# EAGLE schematic GNS_430_PCB_v7 (EAGLE 9.7.0)
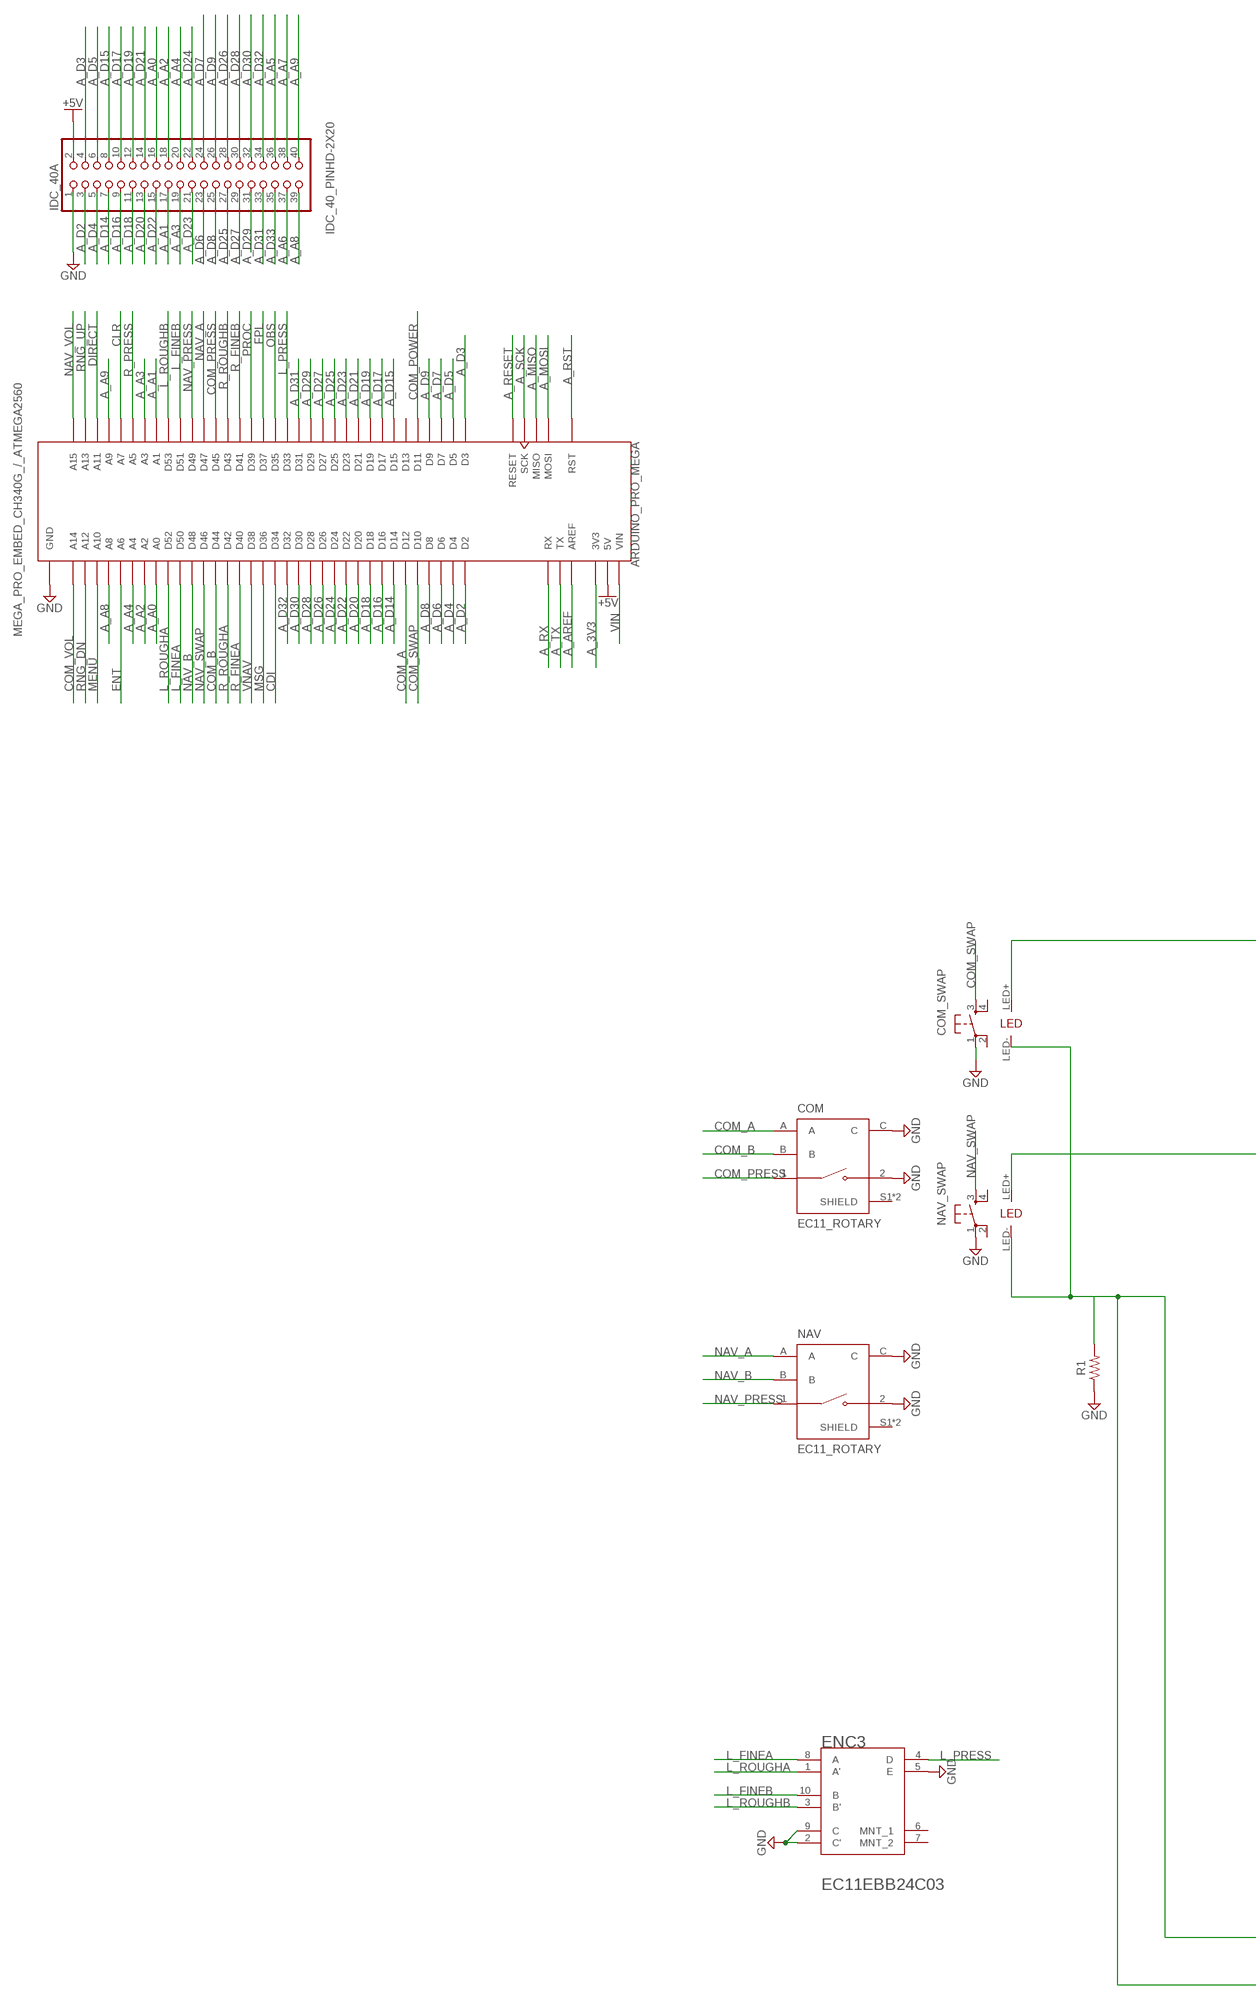
[diagram p0: schematic, sheet 1, part 1 of 2]
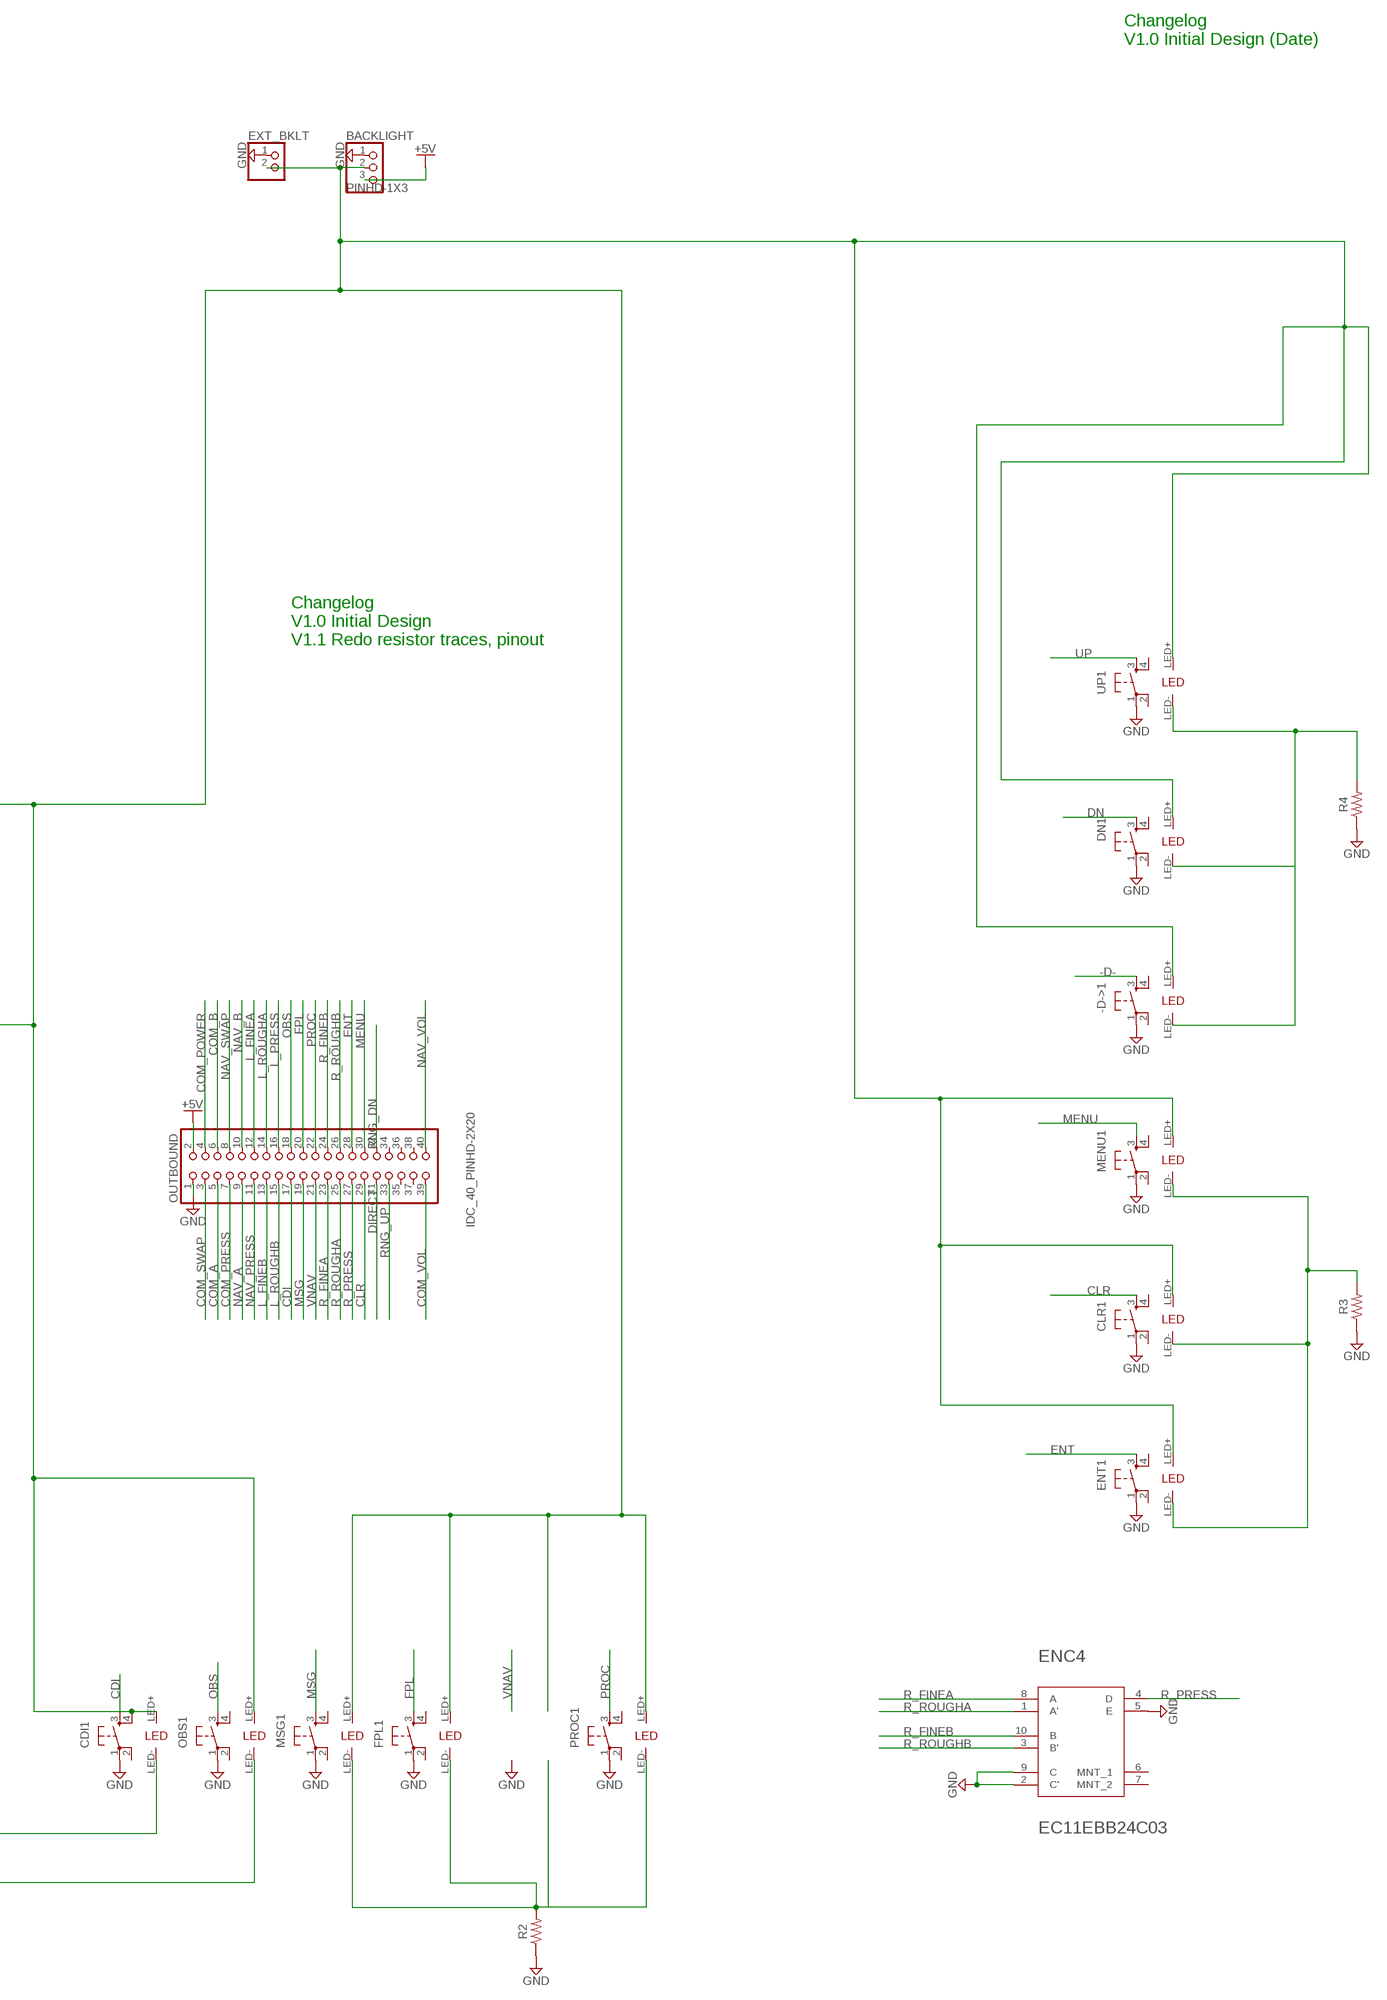
[diagram p1: schematic, sheet 1, part 2 of 2]

## Parts
-D->1  LED_PUSH_7MM  [LED_PUSH_7MM]
ARDUINO_PRO_MEGA  MEGA_PRO_EMBED_CH340G_/_ATMEGA2560  [MODULE_MEGA_PRO_EMBED_CH340G_/_ATMEGA2560]
BACKLIGHT  PINHD-1X3  [1X03]
CDI1  LED_PUSH_7MM  [LED_PUSH_7MM]
CLR1  LED_PUSH_7MM  [LED_PUSH_7MM]
COM  EC11_ROTARY  [SW_482016514001]
COM_SWAP  LED_PUSH_7MM  [LED_PUSH_7MM]
DN1  LED_PUSH_7MM  [LED_PUSH_7MM]
ENC3  ALPS_EC11EBB24C03ALPS_EC11EBB24C03_0_0  [ALPS_EC11EBB24C03_0]
ENC4  ALPS_EC11EBB24C03ALPS_EC11EBB24C03_0_0  [ALPS_EC11EBB24C03_0]
ENT1  LED_PUSH_7MM  [LED_PUSH_7MM]
EXT_BKLT  PINHD-1X2  [1X02]
FPL1  LED_PUSH_7MM  [LED_PUSH_7MM]
IDC_40A  IDC_40_PINHD-2X20  [IDC_40_2X20]
MENU1  LED_PUSH_7MM  [LED_PUSH_7MM]
MSG1  LED_PUSH_7MM  [LED_PUSH_7MM]
NAV  EC11_ROTARY  [SW_482016514001]
NAV_SWAP  LED_PUSH_7MM  [LED_PUSH_7MM]
OBS1  LED_PUSH_7MM  [LED_PUSH_7MM]
OUTBOUND  IDC_40_PINHD-2X20  [IDC_40_2X20]
PROC1  LED_PUSH_7MM  [LED_PUSH_7MM]
R1  R-US_AXIAL-7.2MM-PITCH  [RESAD724W46L381D178B]
R2  R-US_AXIAL-7.2MM-PITCH  [RESAD724W46L381D178B]
R3  R-US_AXIAL-7.2MM-PITCH  [RESAD724W46L381D178B]
R4  R-US_AXIAL-7.2MM-PITCH  [RESAD724W46L381D178B]
UP1  LED_PUSH_7MM  [LED_PUSH_7MM]

## Nets
+5V: ARDUINO_PRO_MEGA.5V_1(5V) ARDUINO_PRO_MEGA.5V_2(5V) ARDUINO_PRO_MEGA.5V_3(5V) BACKLIGHT.3 IDC_40A.2 OUTBOUND.2
-D-: -D->1.3
A_3V3: ARDUINO_PRO_MEGA.3V3_1(3V3) ARDUINO_PRO_MEGA.3V3_2(3V3)
A_A0: ARDUINO_PRO_MEGA.A0 IDC_40A.16
A_A1: ARDUINO_PRO_MEGA.A1 IDC_40A.17
A_A2: ARDUINO_PRO_MEGA.A2 IDC_40A.18
A_A3: ARDUINO_PRO_MEGA.A3 IDC_40A.19
A_A4: ARDUINO_PRO_MEGA.A4 IDC_40A.20
A_A5: IDC_40A.36
A_A6: IDC_40A.37
A_A7: IDC_40A.38
A_A8: ARDUINO_PRO_MEGA.A8 IDC_40A.39
A_A9: ARDUINO_PRO_MEGA.A9 IDC_40A.40
A_AREF: ARDUINO_PRO_MEGA.AREF
A_D2: ARDUINO_PRO_MEGA.D2 IDC_40A.3
A_D3: ARDUINO_PRO_MEGA.D3 IDC_40A.4
A_D4: ARDUINO_PRO_MEGA.D4 IDC_40A.5
A_D5: ARDUINO_PRO_MEGA.D5 IDC_40A.6
A_D6: ARDUINO_PRO_MEGA.D6 IDC_40A.23
A_D7: ARDUINO_PRO_MEGA.D7 IDC_40A.24
A_D8: ARDUINO_PRO_MEGA.D8 IDC_40A.25
A_D9: ARDUINO_PRO_MEGA.D9 IDC_40A.26
A_D14: ARDUINO_PRO_MEGA.D14 IDC_40A.7
A_D15: ARDUINO_PRO_MEGA.D15 IDC_40A.8
A_D16: ARDUINO_PRO_MEGA.D16 IDC_40A.9
A_D17: ARDUINO_PRO_MEGA.D17 IDC_40A.10
A_D18: ARDUINO_PRO_MEGA.D18 IDC_40A.11
A_D19: ARDUINO_PRO_MEGA.D19 IDC_40A.12
A_D20: ARDUINO_PRO_MEGA.D20 IDC_40A.13
A_D21: ARDUINO_PRO_MEGA.D21 IDC_40A.14
A_D22: ARDUINO_PRO_MEGA.D22 IDC_40A.15
A_D23: ARDUINO_PRO_MEGA.D23 IDC_40A.21
A_D24: ARDUINO_PRO_MEGA.D24 IDC_40A.22
A_D25: ARDUINO_PRO_MEGA.D25 IDC_40A.27
A_D26: ARDUINO_PRO_MEGA.D26 IDC_40A.28
A_D27: ARDUINO_PRO_MEGA.D27 IDC_40A.29
A_D28: ARDUINO_PRO_MEGA.D28 IDC_40A.30
A_D29: ARDUINO_PRO_MEGA.D29 IDC_40A.31
A_D30: ARDUINO_PRO_MEGA.D30 IDC_40A.32
A_D31: ARDUINO_PRO_MEGA.D31 IDC_40A.33
A_D32: ARDUINO_PRO_MEGA.D32 IDC_40A.34
A_D33: IDC_40A.35
A_MISO: ARDUINO_PRO_MEGA.MISO
A_MOSI: ARDUINO_PRO_MEGA.MOSI
A_RESET: ARDUINO_PRO_MEGA.RESET
A_RST: ARDUINO_PRO_MEGA.RST
A_RX: ARDUINO_PRO_MEGA.RX
A_SCK: ARDUINO_PRO_MEGA.SCK
A_TX: ARDUINO_PRO_MEGA.TX
CDI: ARDUINO_PRO_MEGA.D34 CDI1.3 OUTBOUND.17
CLR: ARDUINO_PRO_MEGA.A7 CLR1.3 OUTBOUND.29
COM_A: ARDUINO_PRO_MEGA.D12 COM.A OUTBOUND.5
COM_B: ARDUINO_PRO_MEGA.D44 COM.B OUTBOUND.6
COM_POWER: ARDUINO_PRO_MEGA.D11 OUTBOUND.4
COM_PRESS: ARDUINO_PRO_MEGA.D45 COM.1 OUTBOUND.7
COM_SWAP: ARDUINO_PRO_MEGA.D10 COM_SWAP.3 OUTBOUND.3
COM_VOL: ARDUINO_PRO_MEGA.A14 OUTBOUND.39
DIRECT: ARDUINO_PRO_MEGA.A11 OUTBOUND.31
DN: DN1.3
ENT: ARDUINO_PRO_MEGA.A6 ENT1.3 OUTBOUND.28
FPL: ARDUINO_PRO_MEGA.D37 FPL1.3 OUTBOUND.20
GND: -D->1.1 ARDUINO_PRO_MEGA.GND_1(GND) ARDUINO_PRO_MEGA.GND_2(GND) ARDUINO_PRO_MEGA.GND_3(GND) BACKLIGHT.1 CDI1.1 CLR1.1 COM.2 COM.C COM_SWAP.1 DN1.1 ENC3.2(C') ENC3.5(E) ENC3.9(C) ENC4.2(C') ENC4.5(E) ENC4.9(C) ENT1.1 EXT_BKLT.1 FPL1.1 IDC_40A.1 MENU1.1 MSG1.1 NAV.2 NAV.C NAV_SWAP.1 OBS1.1 OUTBOUND.1 PROC1.1 R1.1 R2.1 R3.1 R4.1 UP1.1
L_FINEA: ARDUINO_PRO_MEGA.D50 ENC3.8(A) OUTBOUND.12
L_FINEB: ARDUINO_PRO_MEGA.D51 ENC3.10(B) OUTBOUND.13
L_PRESS: ARDUINO_PRO_MEGA.D33 ENC3.4(D) OUTBOUND.16
L_ROUGHA: ARDUINO_PRO_MEGA.D52 ENC3.1(A') OUTBOUND.14
L_ROUGHB: ARDUINO_PRO_MEGA.D53 ENC3.3(B') OUTBOUND.15
MENU: ARDUINO_PRO_MEGA.A10 MENU1.3 OUTBOUND.30
MSG: ARDUINO_PRO_MEGA.D36 MSG1.3 OUTBOUND.19
N$13: -D->1.LED+ BACKLIGHT.2 CDI1.4 CDI1.LED+ CLR1.LED+ COM_SWAP.LED+ DN1.LED+ ENT1.LED+ EXT_BKLT.2 FPL1.LED+ MENU1.LED+ MSG1.LED+ NAV_SWAP.LED+ OBS1.LED+ PROC1.LED+ UP1.LED+
N$23: CDI1.LED- COM_SWAP.LED- NAV_SWAP.LED- OBS1.LED- R1.2
N$24: FPL1.LED- MSG1.LED- PROC1.LED- R2.2
N$34: CLR1.LED- ENT1.LED- MENU1.LED- R3.2
N$35: -D->1.LED- DN1.LED- R4.2 UP1.LED-
NAV_A: ARDUINO_PRO_MEGA.D47 NAV.A OUTBOUND.9
NAV_B: ARDUINO_PRO_MEGA.D48 NAV.B OUTBOUND.10
NAV_PRESS: ARDUINO_PRO_MEGA.D49 NAV.1 OUTBOUND.11
NAV_SWAP: ARDUINO_PRO_MEGA.D46 NAV_SWAP.3 OUTBOUND.8
NAV_VOL: ARDUINO_PRO_MEGA.A15 OUTBOUND.40
OBS: ARDUINO_PRO_MEGA.D35 OBS1.3 OUTBOUND.18
PROC: ARDUINO_PRO_MEGA.D39 OUTBOUND.22 PROC1.3
R_FINEA: ARDUINO_PRO_MEGA.D40 ENC4.8(A) OUTBOUND.23
R_FINEB: ARDUINO_PRO_MEGA.D41 ENC4.10(B) OUTBOUND.24
R_PRESS: ARDUINO_PRO_MEGA.A5 ENC4.4(D) OUTBOUND.27
R_ROUGHA: ARDUINO_PRO_MEGA.D42 ENC4.1(A') OUTBOUND.25
R_ROUGHB: ARDUINO_PRO_MEGA.D43 ENC4.3(B') OUTBOUND.26
RNG_DN: ARDUINO_PRO_MEGA.A12 OUTBOUND.32
RNG_UP: ARDUINO_PRO_MEGA.A13 OUTBOUND.33
UP: UP1.3
VIN: ARDUINO_PRO_MEGA.VIN_1(VIN) ARDUINO_PRO_MEGA.VIN_2(VIN)
VNAV: ARDUINO_PRO_MEGA.D38 OUTBOUND.21
Unconnected: -D->1.2 -D->1.4 ARDUINO_PRO_MEGA.D13 CDI1.2 CLR1.2 CLR1.4 COM.S1(SHIELD) COM.S2(SHIELD) COM_SWAP.2 COM_SWAP.4 DN1.2 DN1.4 ENC3.6(MNT_1) ENC3.7(MNT_2) ENC4.6(MNT_1) ENC4.7(MNT_2) ENT1.2 ENT1.4 FPL1.2 FPL1.4 MENU1.2 MENU1.4 MSG1.2 MSG1.4 NAV.S1(SHIELD) NAV.S2(SHIELD) NAV_SWAP.2 NAV_SWAP.4 OBS1.2 OBS1.4 OUTBOUND.34 OUTBOUND.35 OUTBOUND.36 OUTBOUND.37 OUTBOUND.38 PROC1.2 PROC1.4 UP1.2 UP1.4

## Notes on the sheet
- Changelog
  V1.0 Initial Design (Date)
- Changelog
  V1.0 Initial Design 
  V1.1 Redo resistor traces, pinout

## Library data of the parts
-D->1 CDI1 CLR1 COM_SWAP DN1 ENT1 FPL1 MENU1 MSG1 NAV_SWAP OBS1 PROC1 UP1 = CaptainBobSim Library, custom:LED_PUSH_7MM
ARDUINO_PRO_MEGA = SnapEDA Library:MEGA_PRO_EMBED_CH340G_/_ATMEGA2560: Mega 2560 PRO (Embed) CH340G/ATmega2560-16AU; MANUFACTURER: Robotdyn; PARTREV: 12/May/2017; STANDARD: Manufacturer Recommendations
BACKLIGHT = Connector:PINHD-1X3: PIN HEADER; CATEGORY: Headers; DESCRIPTION: Header, Straight, 3 Position; MANUFACTURER: Generic; MPN: Generic; OPERATING_TEMPERATURE: Generic; PART_STATUS: Active; PITCH: 0.100" (2.54mm); ROHS_COMPLIANCE: Generic; SERIES: Generic; SUB-CATEGORY: Headers, Male Pins; TYPE: Board to Board or Cable, Unshrouded, Through Hole, Straight
COM NAV = SnapEDA Library:EC11_ROTARY: Rotary Encoder Mechanical 15 Quadrature (Incremental) Vertical; MANUFACTURER: Wurth Electronics; MAXIMUM_PACKAGE_HEIGHT: 26.9 mm; PARTREV: 001.000; STANDARD: Manufacturer Recommendations
ENC3 ENC4 = ALPS Dual Library:ALPS_EC11EBB24C03: Compact and highly reliable type available in many varieties; CENTROID_NOT_SPECIFIED: No; DATASHEET: http://www.alps.com/prod/info/E/HTML/Encoder/Incremental/EC11/EC11EBB24C03.html; DIGIKEY_DESCRIPTION: ENC; LEAD_FREE: yes; MF: ALPS; MOUNTING_STYLE: PCB Mount; MOUSER_PART_NUMBER: 688-EC11EBB24C03; MPN: EC11EBB24C03; NUMBER_OF_CHANNELS: 2 Channel; NUMBER_OF_DETENTS: 30 Detent; OPERATING_LIFE_(CYCLES): 15000; OUTPUT_TYPE: Quadrature; PACKAGE: ENCODER_PTH_11MM7X12MM0; PREFIX: ENC; RATING: 10mA 5VDC; RESOLUTION: 15 PPR; ROHS: yes; TECHNOLOGY: Rotary; TEMPERATURE_RANGE_HIGH: +85°C; TEMPERATURE_RANGE_LOW: -40°C; TERMINATION_STYLE: Through Hole; TYPE: Incremental
EXT_BKLT = pinhead:PINHD-1X2: PIN HEADER
IDC_40A OUTBOUND = CaptainBobSim Library, custom:IDC_40_PINHD-2X20: PIN HEADER
R1-R4 = Resistor:R-US: Resistor Fixed - ANSI; CATEGORY: Resistor; SUB-CATEGORY: Fixed